# Altium project spb_project.PrjPcb
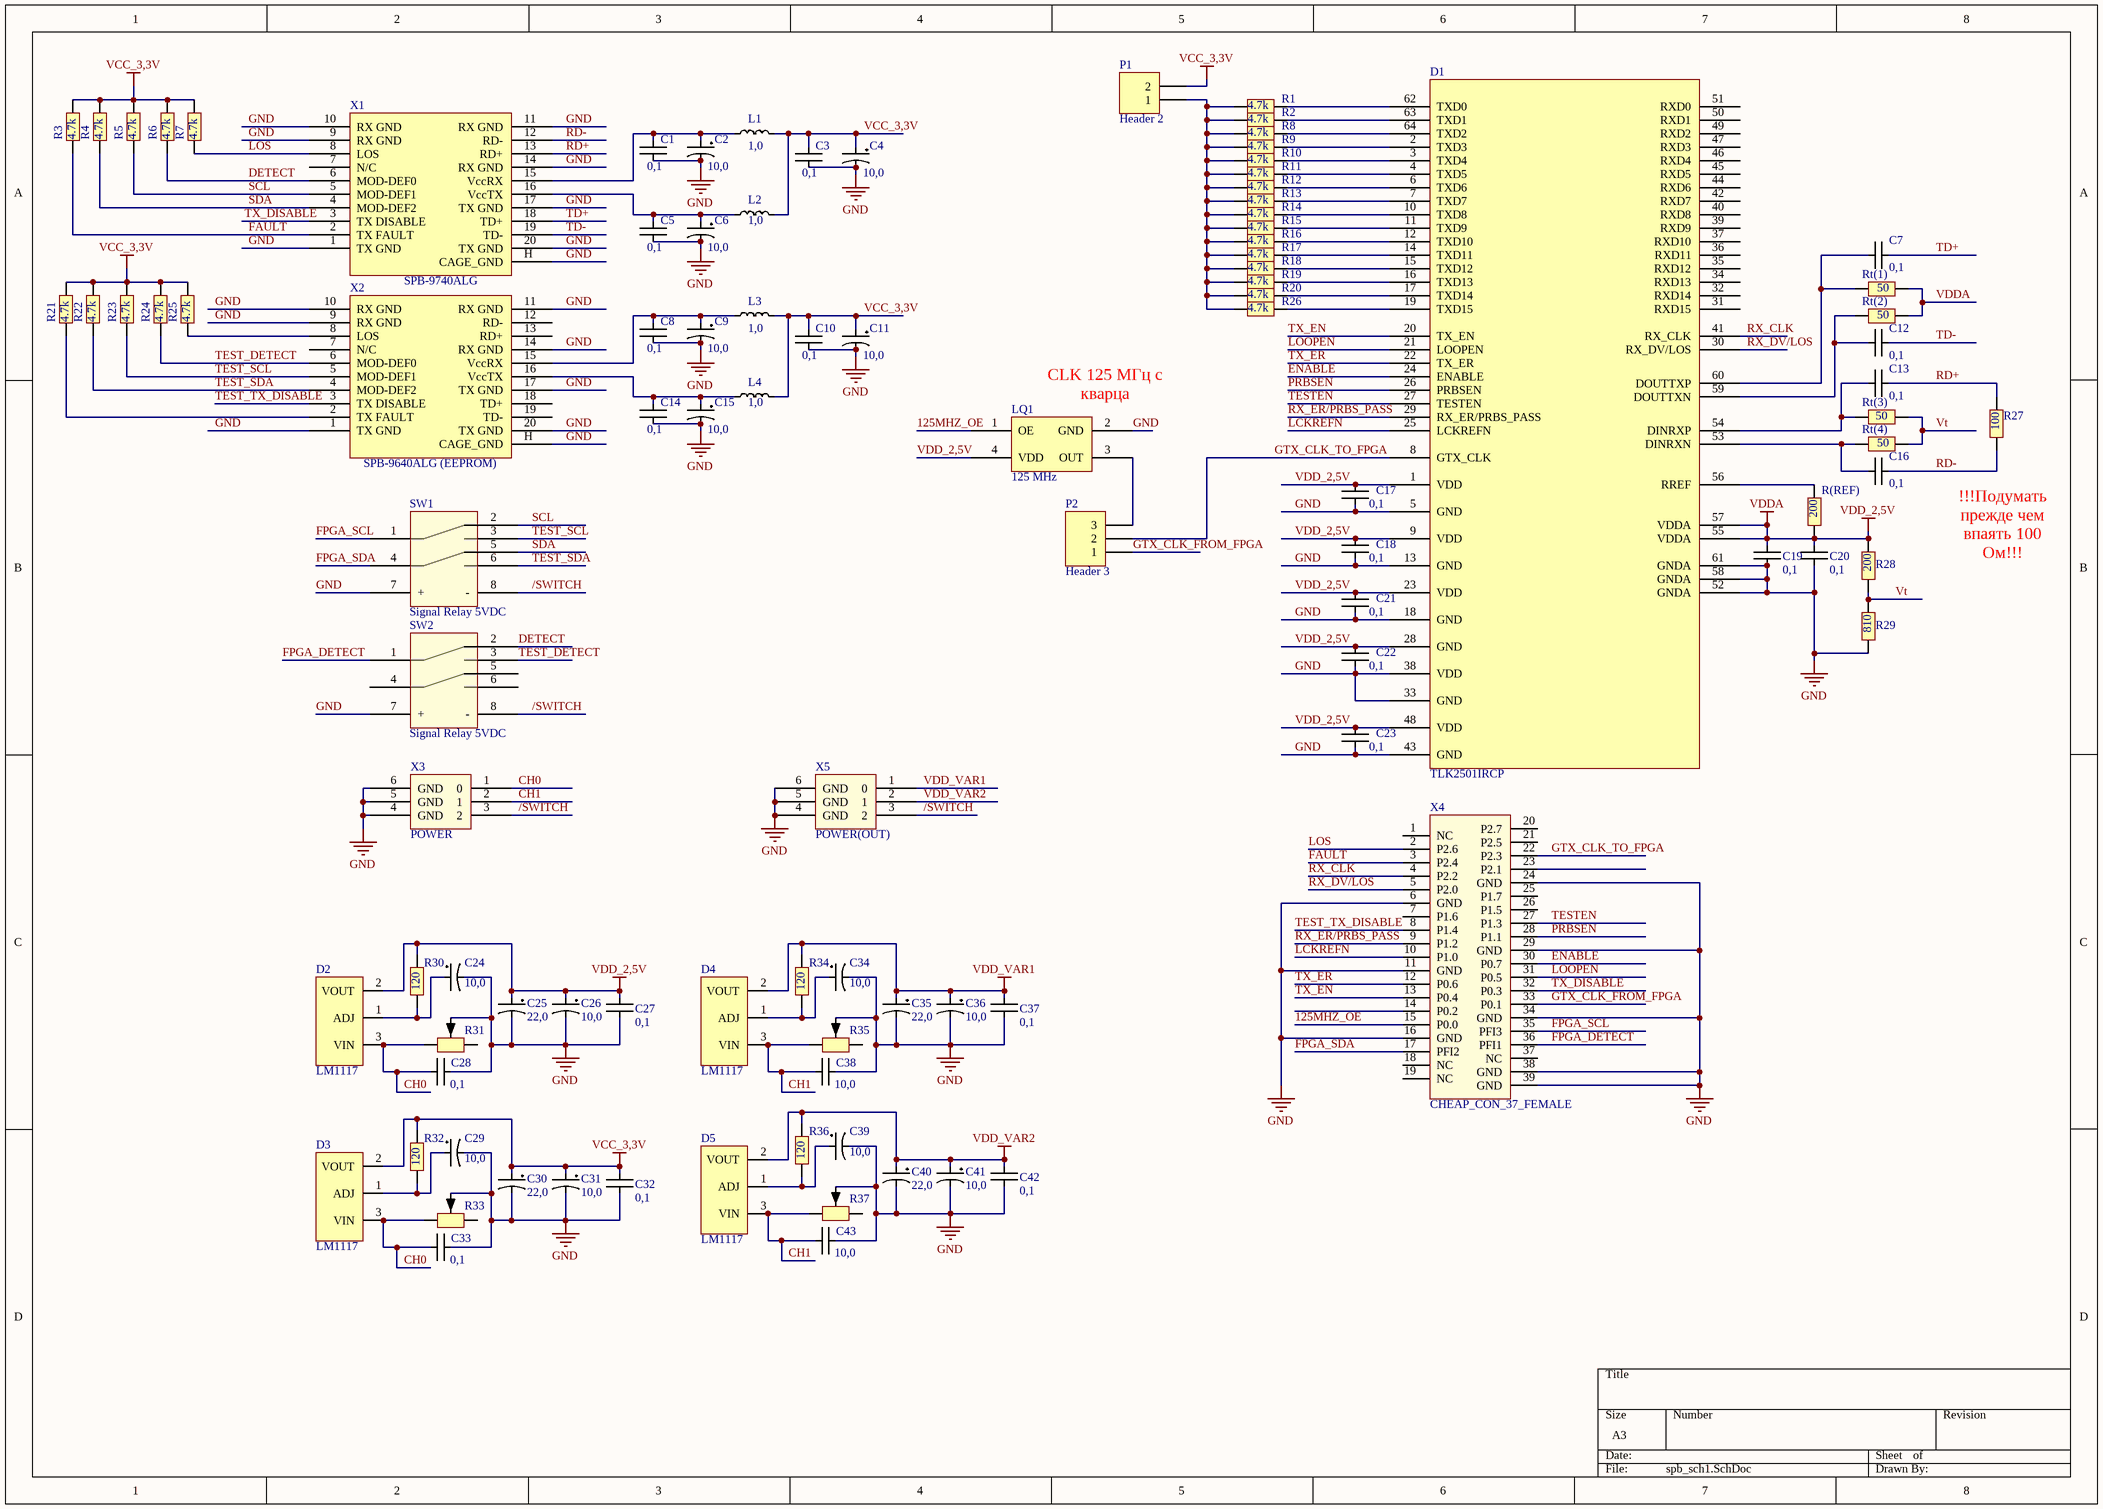
[diagram p0: spb_sch1.SchDoc]
1 sheet, 104 parts. Net scope: global (net labels, ports and power ports of the same name join across sheets).
Board file: spb_pcb.PcbDoc

## Sheet spb_sch1.SchDoc
size A3

### Parts
C1  0,1  [0805]
C2  10,0  [TYPE_C]
C3  0,1  [0805]
C4  10,0  [TYPE_C]
C5  0,1  [0805]
C6  10,0  [TYPE_C]
C7  0,1  [0805]
C8  0,1  [0805]
C9  10,0  [TYPE_C]
C10  0,1  [0805]
C11  10,0  [TYPE_C]
C12  0,1  [0805]
C13  0,1  [0805]
C14  0,1  [0805]
C15  10,0  [TYPE_C]
C16  0,1  [0805]
C17  0,1  [0805]
C18  0,1  [0805]
C19  0,1  [0805]
C20  0,1  [0805]
C21  0,1  [0805]
C22  0,1  [0805]
C23  0,1  [0805]
C24  10,0  [TYPE_C]
C25  22,0  [TYPE_C]
C26  10,0  [TYPE_C]
C27  0,1  [0805]
C28  0,1  [0805]
C29  10,0  [TYPE_C]
C30  22,0  [TYPE_C]
C31  10,0  [TYPE_C]
C32  0,1  [0805]
C33  0,1  [0805]
C34  10,0  [TYPE_C]
C35  22,0  [TYPE_C]
C36  10,0  [TYPE_C]
C37  0,1  [0805]
C38  10,0  [0805]
C39  10,0  [TYPE_C]
C40  22,0  [TYPE_C]
C41  10,0  [TYPE_C]
C42  0,1  [0805]
C43  10,0  [0805]
D1  TLK2501IRCP  [Quad64]
D2  LM1117  [TO-252]
D3  LM1117  [TO-252]
D4  LM1117  [TO-252]
D5  LM1117  [TO-252]
L1  1,0  [0805]
L2  1,0  [0805]
L3  1,0  [0805]
L4  1,0  [0805]
LQ1  125 MHz  [SOC7 SMD Clock Oscillator]
P1  Header 2  [HDR1X2]
P2  Header 3  [HDR1X3]
R1  4.7k  [0805]
R2  4.7k  [0805]
R3  4.7k  [0805]
R4  4.7k  [0805]
R5  4.7k  [0805]
R6  4.7k  [0805]
R7  4.7k  [0805]
R8  4.7k  [0805]
R9  4.7k  [0805]
R10  4.7k  [0805]
R11  4.7k  [0805]
R12  4.7k  [0805]
R13  4.7k  [0805]
R14  4.7k  [0805]
R15  4.7k  [0805]
R16  4.7k  [0805]
R17  4.7k  [0805]
R18  4.7k  [0805]
R19  4.7k  [0805]
R20  4.7k  [0805]
R21  4.7k  [0805]
R22  4.7k  [0805]
R23  4.7k  [0805]
R24  4.7k  [0805]
R25  4.7k  [0805]
R26  4.7k  [0805]
R27  100  [0805]
R28  200  [0805]
R29  810  [0805]
R30  120  [0805]
R31  RES_VAR  [3006P]  (value not drawn)
R32  120  [0805]
R33  RES_VAR  [3006P]  (value not drawn)
R34  120  [0805]
R35  RES_VAR  [3006P]  (value not drawn)
R36  120  [0805]
R37  RES_VAR  [3006P]  (value not drawn)
R(REF)  200  [0805]
Rt(1)  50  [0805]
Rt(2)  50  [0805]
Rt(3)  50  [0805]
Rt(4)  50  [0805]
SW1  Signal Relay 5VDC  [V23079 Relay]
SW2  Signal Relay 5VDC  [V23079 Relay]
X1  SPB-9740ALG  [SFP-20pin]
X2  SPB-9640ALG (EEPROM)  [SFP-20pin]
X3  POWER  [POWER]
X4  CHEAP_CON_37_FEMALE  [CHEAP_CONN_FEMALE]
X5  POWER(OUT)  [POWER]

### Nets
GND: C1.2 C2.1 C3.2 C4.1 C5.2 C6.1 C8.2 C9.1 C10.2 C11.1 C14.2 C15.1 C17.2 C18.2 C19.1 C20.1 C21.2 C22.2 C23.2 C24.1 C25.1 C26.1 C27.1 C28.2 C29.1 C30.1 C31.1 C32.1 C33.2 C34.1 C35.1 C36.1 C37.1 C38.2 C39.1 C40.1 C41.1 C42.1 C43.2 D1.5(GND) D1.13(GND) D1.18(GND) D1.33(GND) D1.38(VDD) D1.43(GND) D1.52(GNDA) D1.58(GNDA) D1.61(GNDA) LQ1.2(GND) R29.1 R31.2 R33.2 R35.2 R37.2 SW1.7(+) SW2.7(+) X1.1(TX_GND) X1.9(RX_GND) X1.10(RX_GND) X1.11(RX_GND) X1.14(RX_GND) X1.17(TX_GND) X1.20(TX_GND) X1.H(CAGE_GND) X2.1(TX_GND) X2.9(RX_GND) X2.10(RX_GND) X2.11(RX_GND) X2.14(RX_GND) X2.17(TX_GND) X2.20(TX_GND) X2.H(CAGE_GND) X3.4(GND) X3.5(GND) X3.6(GND) X4.6(GND) X4.11(GND) X4.16(GND) X4.24(GND) X4.29(GND) X4.34(GND) X4.38(GND) X4.39(GND) X5.4(GND) X5.5(GND) X5.6(GND)
VCC_3,3V: C3.1 C4.2 C10.1 C11.2 C30.2 C31.2 C32.2 D3.2(VOUT) L1.2 L2.2 L3.2 L4.2 P1.2 R3.1 R4.1 R5.1 R6.1 R7.1 R21.1 R22.1 R23.1 R24.1 R25.1 R32.1
VDD_2,5V: C17.1 C18.1 C19.2 C20.2 C21.1 C22.1 C23.1 C25.2 C26.2 C27.2 D1.1(VDD) D1.9(VDD) D1.23(VDD) D1.28(GND) D1.48(VDD) D1.55(VDDA) D1.57(VDDA) D2.2(VOUT) LQ1.4(VDD) R28.2 R30.1 R(REF).1 Rt(1).1 Rt(2).1  [also labelled VDDA]
VDD_VAR1: C35.2 C36.2 C37.2 D4.2(VOUT) R34.1 X5.1(0)
VDD_VAR2: C40.2 C41.2 C42.2 D5.2(VOUT) R36.1 X5.2(1)
125MHZ_OE: LQ1.1(OE) X4.15(P0.0)
/SWITCH: SW1.8(-) SW2.8(-) X3.3(2) X5.3(2)
CH0: C28.1 C33.1 D2.3(VIN) D3.3(VIN) R31.3 R33.3 X3.1(0)
CH1: C38.1 C43.1 D4.3(VIN) D5.3(VIN) R35.3 R37.3 X3.2(1)
DETECT: R6.2 SW2.2(-) X1.6(MOD-DEF0)
ENABLE: D1.24(ENABLE) X4.30(P0.7)
FAULT: R3.2 X1.2(TX_FAULT) X4.3(P2.4)
FPGA_DETECT: SW2.1(-) X4.36(PFI1)
FPGA_SCL: SW1.1(-) X4.35(PFI3)
FPGA_SDA: SW1.4(-) X4.17(PFI2)
GTX_CLK_FROM_FPGA: P2.1 X4.33(P0.1)
GTX_CLK_TO_FPGA: D1.8(GTX_CLK) P2.2 X4.22(P2.3)
LCKREFN: D1.25(LCKREFN) X4.10(P1.0)
LOOPEN: D1.21(LOOPEN) X4.31(P0.5)
LOS: R7.2 X1.8(LOS) X4.2(P2.6)
PRBSEN: D1.26(PRBSEN) X4.28(P1.1)
RD+: C13.1 R27.1 X1.13(RD+)
RD-: C16.1 R27.2 X1.12(RD-)
RX_CLK: D1.41(RX_CLK) X4.4(P2.2)
RX_DV/LOS: D1.30(RX_DV/LOS) X4.5(P2.0)
RX_ER/PRBS_PASS: D1.29(RX_ER/PRBS_PASS) X4.9(P1.2)
SCL: R5.2 SW1.2(-) X1.5(MOD-DEF1)
SDA: R4.2 SW1.5(-) X1.4(MOD-DEF2)
TD+: C7.1 X1.18(TD+)
TD-: C12.1 X1.19(TD-)
TEST_DETECT: R24.2 SW2.3(-) X2.6(MOD-DEF0)
TEST_SCL: R23.2 SW1.3(-) X2.5(MOD-DEF1)
TEST_SDA: R22.2 SW1.6(-) X2.4(MOD-DEF2)
TEST_TX_DISABLE: X2.3(TX_DISABLE) X4.8(P1.4)
TESTEN: D1.27(TESTEN) X4.27(P1.3)
TX_DISABLE: X1.3(TX_DISABLE) X4.32(P0.3)
TX_EN: D1.20(TX_EN) X4.13(P0.4)
TX_ER: D1.22(TX_ER) X4.12(P0.6)
Vt: R28.1 R29.2 Rt(3).1 Rt(4).1
NetC1_1: C1.1 C2.2 L1.1 X1.15(VccRX)
NetC5_1: C5.1 C6.2 L2.1 X1.16(VccTX)
NetC7_2: C7.2 D1.60(DOUTTXP) Rt(1).2
NetC8_1: C8.1 C9.2 L3.1 X2.15(VccRX)
NetC12_2: C12.2 D1.59(DOUTTXN) Rt(2).2
NetC13_2: C13.2 D1.54(DINRXP) Rt(3).2
NetC14_1: C14.1 C15.2 L4.1 X2.16(VccTX)
NetC16_2: C16.2 D1.53(DINRXN) Rt(4).2
NetC24_2: C24.2 D2.1(ADJ) R30.2
NetC29_2: C29.2 D3.1(ADJ) R32.2
NetC34_2: C34.2 D4.1(ADJ) R34.2
NetC39_2: C39.2 D5.1(ADJ) R36.2
NetD1_2: D1.2(TXD3) R9.2
NetD1_3: D1.3(TXD4) R10.2
NetD1_4: D1.4(TXD5) R11.2
NetD1_6: D1.6(TXD6) R12.2
NetD1_7: D1.7(TXD7) R13.2
NetD1_10: D1.10(TXD8) R14.2
NetD1_11: D1.11(TXD9) R15.2
NetD1_12: D1.12(TXD10) R16.2
NetD1_14: D1.14(TXD11) R17.2
NetD1_15: D1.15(TXD12) R18.2
NetD1_16: D1.16(TXD13) R19.2
NetD1_17: D1.17(TXD14) R20.2
NetD1_19: D1.19(TXD15) R26.2
NetD1_56: D1.56(RREF) R(REF).2
NetD1_62: D1.62(TXD0) R1.2
NetD1_63: D1.63(TXD1) R2.2
NetD1_64: D1.64(TXD2) R8.2
NetLQ1_3: LQ1.3(OUT) P2.3
NetP1_1: P1.1 R1.1 R2.1 R8.1 R9.1 R10.1 R11.1 R12.1 R13.1 R14.1 R15.1 R16.1 R17.1 R18.1 R19.1 R20.1 R26.1
NetR21_2: R21.2 X2.2(TX_FAULT)
NetR25_2: R25.2 X2.8(LOS)

Not connected (* = marked no-connect by the designer): D1 31(RXD15) 32(RXD14) 34(RXD13) 35(RXD12) 36(RXD11) 37(RXD10) 39(RXD9) 40(RXD8) 42(RXD7) 44(RXD6) 45(RXD5) 46(RXD4) 47(RXD3) 49(RXD2) 50(RXD1) 51(RXD0); R31 1; R33 1; R35 1; R37 1; SW2 4(-) 5(-) 6(-); X1 7(N/C); X2 7(N/C) 12(RD-) 13(RD+) 18(TD+) 19(TD-); X4 1(NC) 7(P1.6) 14(P0.2) 18(NC) 19(NC) 20(P2.7) 21(P2.5) 23(P2.1) 25(P1.7) 26(P1.5) 37(NC)

### Notes on the sheet
- (near LQ1) CLK 125 МГц с кварца
- !!!Подумать прежде чем впаять 100 Ом!!!

### Library data of the parts
C1 C3 C5 C7 C8 C10 C12-C14 C16-C23 C27 C28 C32 C33 C37 C38 C42 C43 = CAP_SMALL: 0805
C2 C4 C6 C9 C11 C15 C24-C26 C29-C31 C34-C36 C39-C41 = CAP_TANT: SMD
D2-D5 = LM1117_ADJ
L1-L4 = INDUCT: 0805
LQ1 = SOC7 SMD Clock Oscillator
P1 = Header 2: Header, 2-Pin; LatestRevisionDate: 17-Jul-2002; LatestRevisionNote: Re-released for DXP Platform.; Publisher: Altium Limited
P2 = Header 3: Header, 3-Pin; LatestRevisionDate: 17-Jul-2002; LatestRevisionNote: Re-released for DXP Platform.; Publisher: Altium Limited
R1-R30 R34 R36 R(REF) Rt(1) Rt(2) Rt(3) Rt(4) = RES0805: 0805
R31 R33 R35 R37 = RES_VAR: PV36W102C (СП5-2ВБ) 1 кОм
R32 = RES0805
SW1 SW2 = SWITCH
X1 X2 = SFP-20pin
X5 = POWER